# Altium schematic sheet power.SchDoc
size A4
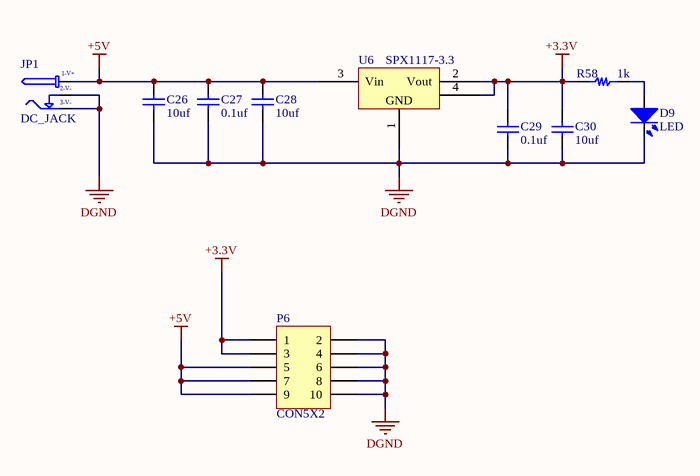
[diagram p0: power.SchDoc]

## Parts
C26  10uf  [0805C]
C27  0.1uf  [0805C]
C28  10uf  [0805C]
C29  0.1uf  [0805C]
C30  10uf  [0805C]
D9  LED  [0805-LED-RED]
JP1  DC_JACK  [DC3]
P6  CON5X2  [HDR2X5-2.54MM]
R58  1k  [0805_small]
U6  SPX1117-3.3  [SOT-223(DCY4)]

## Nets
+3.3V: C29.2 C30.2 P6.1 P6.3 R58.2 U6.2(Vout) U6.4
+5V: C26.2 C27.2 C28.2 JP1.1 P6.5 P6.7 P6.9 U6.3(Vin)
DGND: C26.1 C27.1 C28.1 C29.1 C30.1 D9.2(K) JP1.2 JP1.3 P6.2 P6.4 P6.6 P6.8 P6.10 U6.1
NetD9_1: D9.1(A) R58.1

## Notes on the sheet
- (in symbol DC_JACK) 1-V+; 2-V-; 3-V-
- (in symbol SPX1117) GND

## Library data of the parts
C26-C30 = Cap: 贴片电容; Value: 100pF; Published: 8-Jun-2000; LatestRevisionDate: 17-Jul-2002; LatestRevisionNote: Re-released for DXP Platform.; PackageReference: RAD-0.3; Publisher: Altium Limited
D9 = LED: Typical INFRARED GaAs LED; Published: 8-Jun-2000; LatestRevisionDate: 08-Jul-2005; LatestRevisionNote: Mech Layer 1 removed.; PackageReference: LED-0; Publisher: Altium Limited; PackageDescription: LED; 2 Leads
JP1 = DC_JACK: DC电源接口
P6 = CON5X2: Header, 5-Pin, Dual row; LatestRevisionDate: 17-Jul-2002; LatestRevisionNote: Re-released for DXP Platform.; Publisher: Altium Limited
R58 = Res: 电阻; Value: 230k; Published: 24-Mar-1999; LatestRevisionDate: 29-May-2009; LatestRevisionNote: IPC-7351 Footprint Added.; PackageVersion: Mar-2003; PackageReference: 6-0805; Publisher: Altium Limited; PackageDescription: Chip Resistor 0805 Case Size; Code_IPC: RESC2012
U6 = SPX1117